# Altium schematic sheet SensorNode.SchDoc
size A
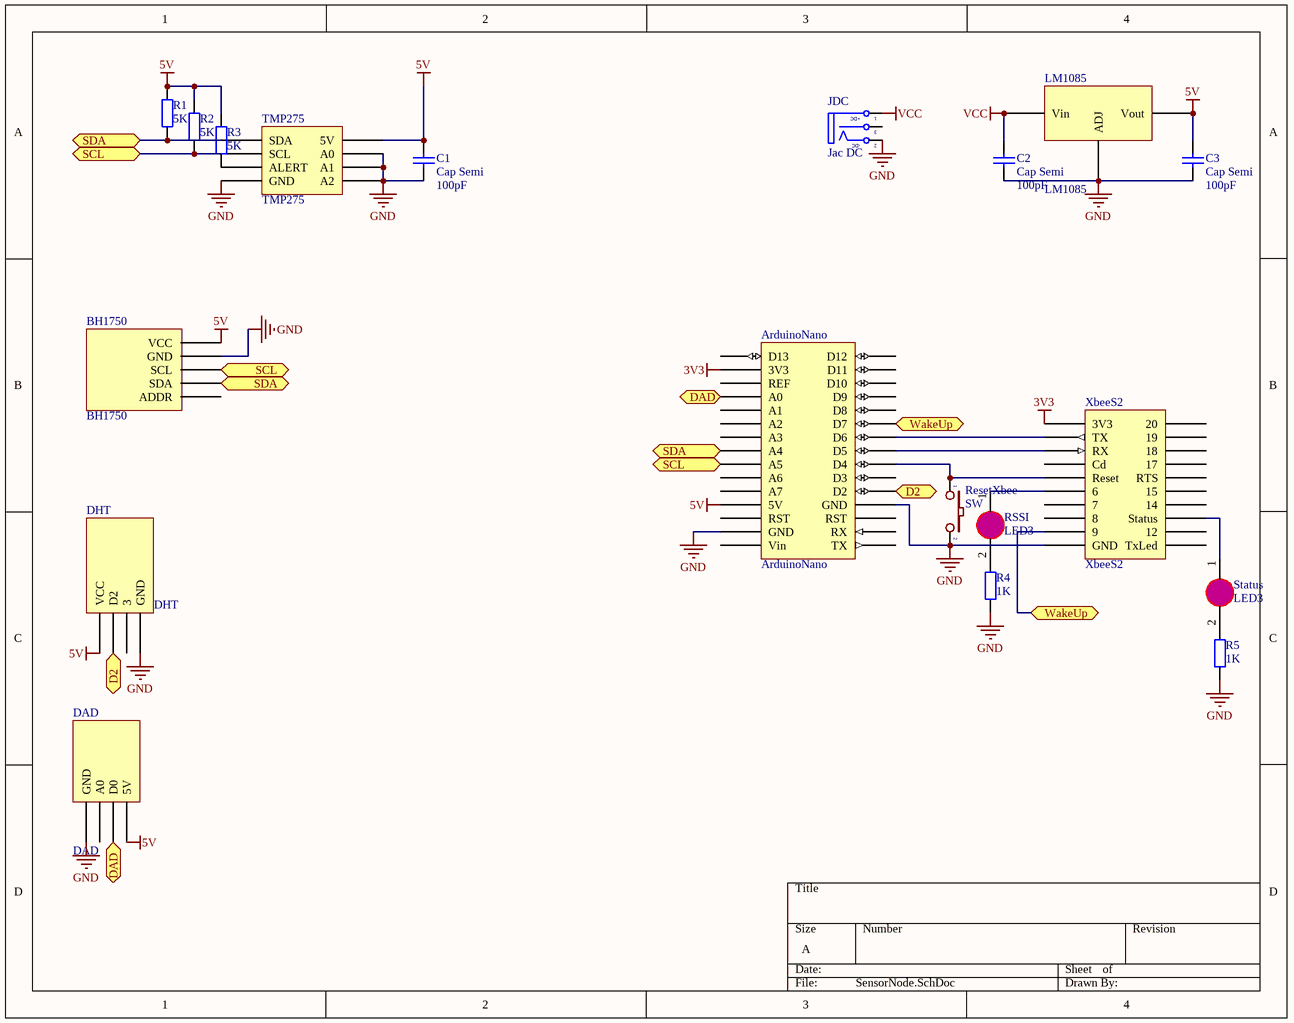
[diagram p0: SensorNode.SchDoc]

## Parts
ArduinoNano  ArduinoNano  [ArduinoNano]
BH1750  BH1750  [BH1750]
C1  Cap Semi  value 100pF  [C1206]
C2  Cap Semi  value 100pF  [C1206]
C3  Cap Semi  value 100pF  [C1206]
DAD  DAD  [HDR1X4]
DHT  DHT  [HDR1X4]
JDC  Jac DC  [DC-IN]
LM1085  LM1085  [LM1085]
R1  value 5K  [SMD0805R]  (hidden comment: R)
R2  value 5K  [SMD0805R]  (hidden comment: R)
R3  value 5K  [SMD0805R]  (hidden comment: R)
R4  value 1K  [SMD0805R]  (hidden comment: R)
R5  value 1K  [SMD0805R]  (hidden comment: R)
ResetXbee  SW  [SW2]
RSSI  LED3  [SMD0805LED]
Status  LED3  [SMD0805LED]
TMP275  TMP275  [SO8_N]
XbeeS2  XbeeS2  [XbeeS2]

## Ports
D2, DAD, SCL, SDA, WakeUp

## Nets
3V3: ArduinoNano.17(3V3) XbeeS2.1(3V3)
5V: ArduinoNano.27(5V) BH1750.5(VCC) C1.1 C3.1 DAD.4(5V) DHT.1(VCC) LM1085.OUTPUT(Vout) R1.2 R2.2 R3.2 TMP275.8(5V)
GND: ArduinoNano.4(GND) ArduinoNano.29(GND) BH1750.4(GND) C1.2 C2.2 C3.2 DAD.1(GND) DHT.4(GND) JDC.2(TN) LM1085.GND(ADJ) R4.1 R5.1 ResetXbee.2 TMP275.4(GND) TMP275.5(A2) TMP275.6(A1) TMP275.7(A0) XbeeS2.10(GND)
VCC: C2.1 JDC.1(T) LM1085.INPUT(Vin)
D2: ArduinoNano.5(D2) DHT.2(D2) ; port D2
DAD: ArduinoNano.19(A0) DAD.3(D0) ; port DAD
SCL: ArduinoNano.24(A5) BH1750.3(SCL) R2.1 TMP275.2(SCL) ; port SCL
SDA: ArduinoNano.23(A4) BH1750.2(SDA) R1.1 TMP275.1(SDA) ; port SDA
WakeUp: ArduinoNano.10(D7) XbeeS2.9 ; port WakeUp
NetArduinoNano_7: ArduinoNano.7(D4) ResetXbee.1 XbeeS2.5(Reset)
NetArduinoNano_8: ArduinoNano.8(D5) XbeeS2.3(RX)
NetArduinoNano_9: ArduinoNano.9(D6) XbeeS2.2(TX)
NetR3_1: R3.1 TMP275.3(ALERT)
NetR4_2: R4.2 RSSI.2(K)
NetR5_2: R5.2 Status.2(K)
NetRSSI_1: RSSI.1(A) XbeeS2.6
NetStatus_1: Status.1(A) XbeeS2.13(Status)

Not connected (* = marked no-connect by the designer): ArduinoNano 1(TX) 2(RX) 3(RST) 6(D3) 11(D8) 12(D9) 13(D10) 14(D11) 15(D12) 16(D13) 18(REF) 20(A1) 21(A2) 22(A3) 25(A6) 26(A7) 28(RST) 30(Vin); BH1750 1(ADDR); DAD 2(A0); DHT 3; JDC 3(S); XbeeS2 4(Cd) 7 8 11(TxLed) 12 14 15 16(RTS) 17 18 19 20

## Notes on the sheet
- (in symbol DCIN) +DC; -DC

## Library data of the parts
C1-C3 = Cap Semi: Capacitor (Semiconductor SIM Model); Published: 8-Jun-2000; LatestRevisionDate: 29-May-2009; LatestRevisionNote: IPC-7351 Footprint Added.; PackageReference: C1206; Publisher: Altium Limited; PackageDescription: Chip Capacitor
JDC = DCIN: Jac DC input; Value: Jac DC
R1-R5 = R: RES_08; Published: 8-Jun-2000; LatestRevisionDate: 17-Jul-2002; LatestRevisionNote: Re-released for DXP Platform.; PackageReference: AXIAL-0.4; Publisher: Altium Limited
ResetXbee = SW2: Switch button 2 pin; Value: SW chip 2 pin
RSSI Status = LEDSMD: LED SMD